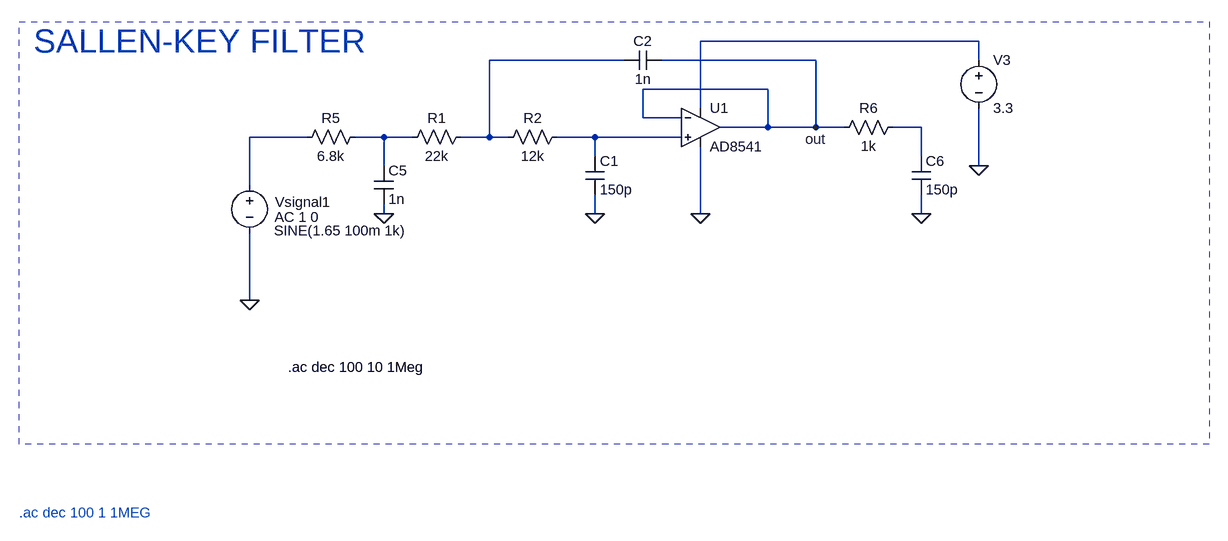
[diagram p0: schematic LTspice_Sallen_key_MCP6001_filter.asc]
LTspice_Sallen_key_MCP6001_filter.asc, the LTspice schematic file:
Version 4.1
SHEET 1 2504 4760
WIRE 848 128 384 128
WIRE 256 160 32 160
WIRE 576 160 320 160
WIRE 848 160 848 128
WIRE 496 208 288 208
WIRE 384 240 384 128
WIRE 288 256 288 208
WIRE 352 256 288 256
WIRE 496 272 496 208
WIRE 496 272 416 272
WIRE 576 272 576 160
WIRE 576 272 496 272
WIRE 624 272 576 272
WIRE 752 272 704 272
WIRE -272 288 -368 288
WIRE -144 288 -192 288
WIRE -96 288 -144 288
WIRE 32 288 32 160
WIRE 32 288 -16 288
WIRE 64 288 32 288
WIRE 208 288 144 288
WIRE 352 288 208 288
WIRE 208 320 208 288
WIRE 752 320 752 272
WIRE -144 336 -144 288
WIRE 848 336 848 240
WIRE -368 368 -368 288
WIRE -144 416 -144 400
WIRE 208 416 208 384
WIRE 384 416 384 304
WIRE 752 416 752 384
WIRE -368 560 -368 448
FLAG -368 560 0
FLAG 208 416 0
FLAG 576 272 out
FLAG 384 416 0
FLAG 848 336 0
FLAG -144 416 0
FLAG 752 416 0
SYMBOL res 0 272 R90
WINDOW 0 0 56 VBottom 2
WINDOW 3 32 56 VTop 2
SYMATTR InstName R1
SYMATTR Value 22k
SYMBOL res 160 272 R90
WINDOW 0 0 56 VBottom 2
WINDOW 3 32 56 VTop 2
SYMATTR InstName R2
SYMATTR Value 12k
SYMBOL cap 192 320 R0
SYMATTR InstName C1
SYMATTR Value 150p
SYMBOL cap 320 144 R90
WINDOW 0 0 32 VBottom 2
WINDOW 3 32 32 VTop 2
SYMATTR InstName C2
SYMATTR Value 1n
SYMBOL voltage -368 352 R0
WINDOW 123 42 70 Left 2
WINDOW 39 0 0 Left 0
WINDOW 3 41 92 Left 2
WINDOW 0 43 45 Left 2
SYMATTR Value2 AC 1 0
SYMATTR Value SINE(1.65 100m 1k)
SYMATTR InstName Vsignal1
SYMBOL OpAmps\\AD8541 384 208 R0
SYMATTR InstName U1
SYMBOL voltage 848 144 R0
WINDOW 123 0 0 Left 0
WINDOW 39 0 0 Left 0
SYMATTR InstName V3
SYMATTR Value 3.3
SYMBOL res -176 272 R90
WINDOW 0 0 56 VBottom 2
WINDOW 3 32 56 VTop 2
SYMATTR InstName R5
SYMATTR Value 6.8k
SYMBOL cap -160 336 R0
SYMATTR InstName C5
SYMATTR Value 1n
SYMBOL res 720 256 R90
WINDOW 0 0 56 VBottom 2
WINDOW 3 32 56 VTop 2
SYMATTR InstName R6
SYMATTR Value 1k
SYMBOL cap 736 320 R0
SYMATTR InstName C6
SYMATTR Value 150p
TEXT -728 128 Left 5 ;SALLEN-KEY FILTER
TEXT -752 4744 Left 2 ;.ac dec 100 1 1MEG
TEXT -304 672 Left 2 !.ac dec 100 10 1Meg
RECTANGLE Normal 1232 800 -752 96 2

The netlist it stands for:
* LTspice_Sallen_key_MCP6001_filter.asc
R1 N002 N005 22k
R2 N006 N002 12k
C1 N006 0 150p
C2 out N002 1n
Vsignal1 N004 0 SINE(1.65 100m 1k) AC 1 0
X§U1 N006 out N001 0 out AD8541  ; pins In+ In- V+ V- OUT
V3 N001 0 3.3
R5 N005 N004 6.8k
C5 N005 0 1n
R6 N003 out 1k
C6 N003 0 150p
* SALLEN-KEY FILTER
* .ac dec 100 1 1MEG
.ac dec 100 10 1Meg
.backanno
.end